# Altium schematic sheet SensorCaida.SchDoc
size A4
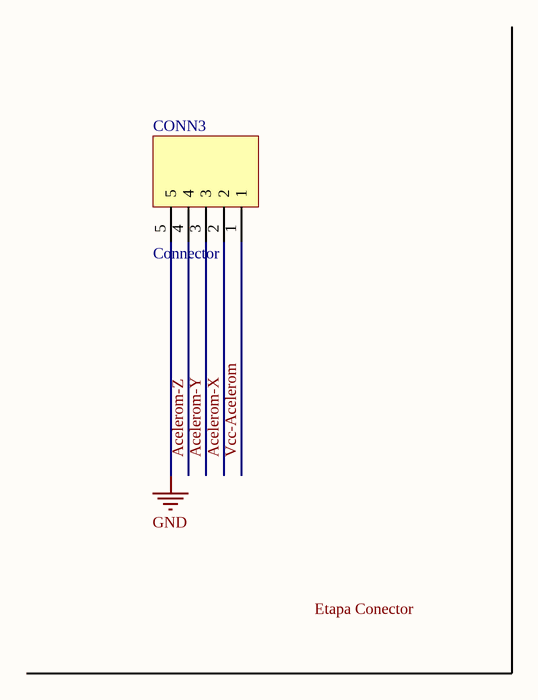
[diagram p0: SensorCaida.SchDoc]

## Parts
CONN3  Connector  [1x5x2.54 Pin Header TH V]

## Nets
GND: CONN3.5
Acelerom-X: CONN3.2
Acelerom-Y: CONN3.3
Acelerom-Z: CONN3.4
Vcc-Acelerom: CONN3.1

## Notes on the sheet
- Labels drawn without touching a wire or pin: Etapa Conector

## Library data of the parts
CONN3 = Header 1x5